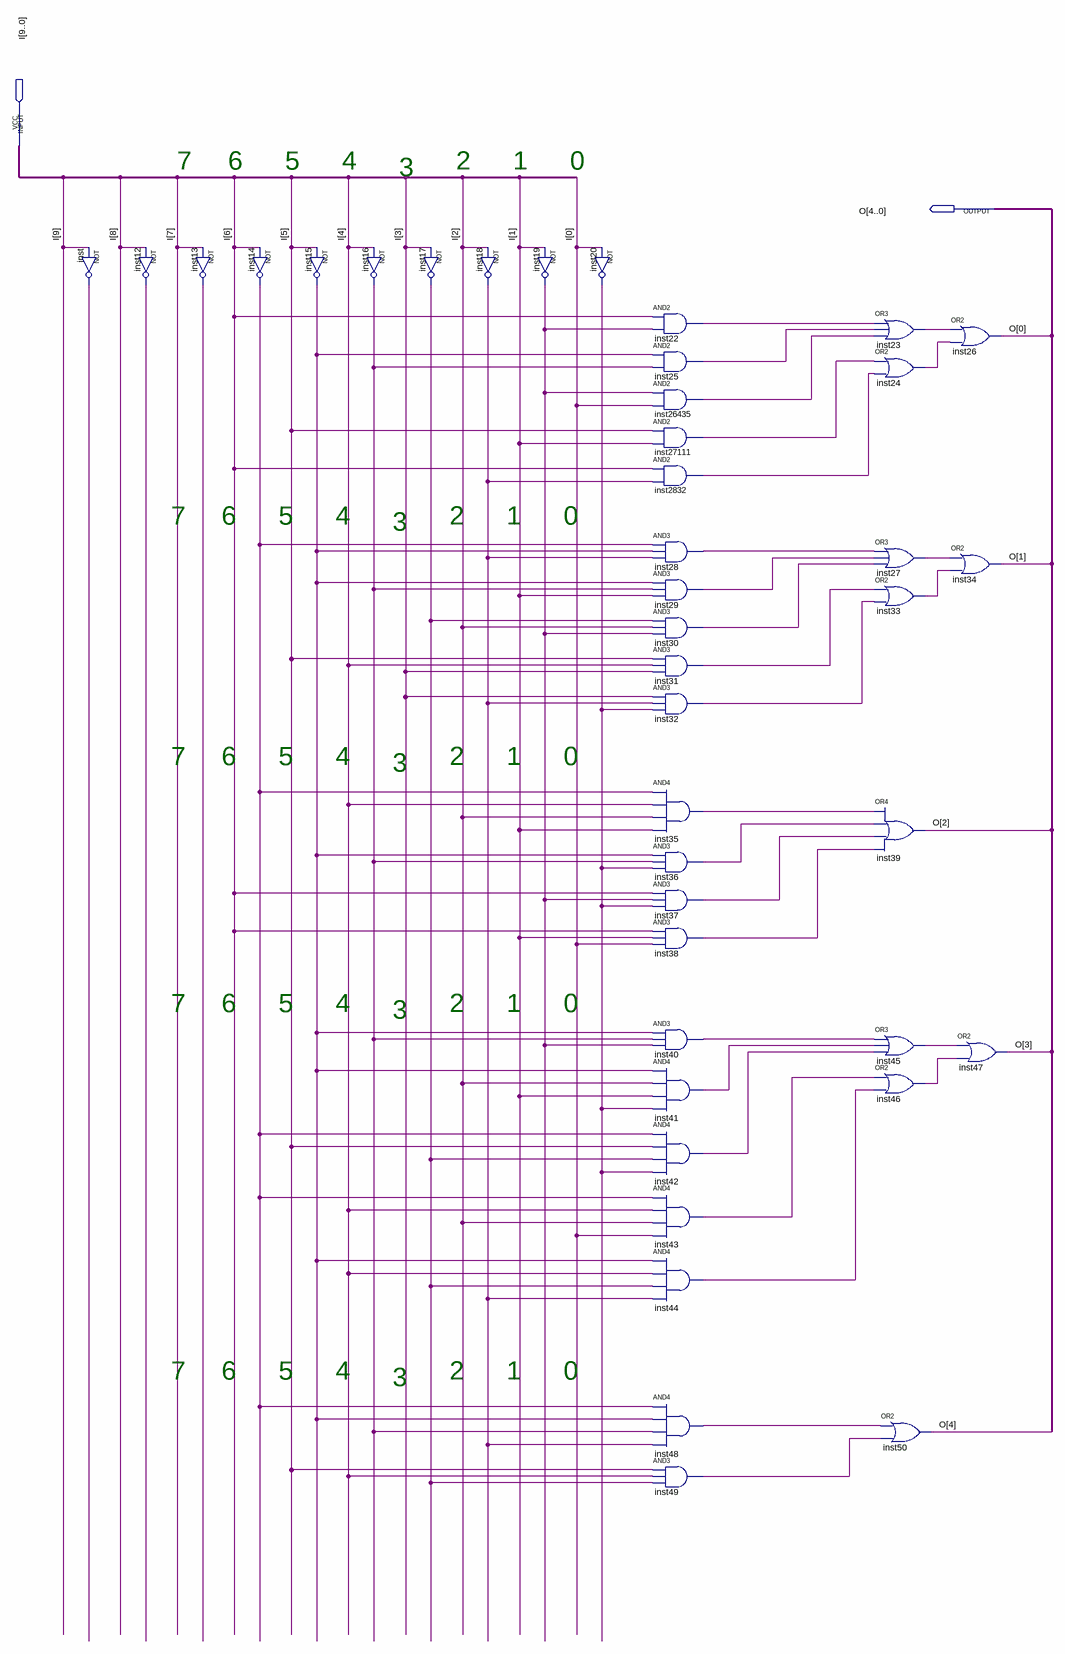
[diagram p0: schematic sheet]
// Quartus schematic Bin2TimeValue.bdf as structural Verilog: 42 symbols, 2 pins
module Bin2TimeValue (
  input  [9:0] I,
  output [4:0] O
);

  wire inst12_out, inst13_out, inst14_out, inst15_out, inst16_out, inst17_out, inst18_out, inst19_out,
       inst20_out, inst22_out, inst23_out, inst24_out, inst25_out, inst27_out, inst28_out, inst29_out,
       inst30_out, inst31_out, inst32_out, inst33_out, inst35_out, inst36_out, inst37_out, inst38_out,
       inst40_out, inst41_out, inst42_out, inst43_out, inst44_out, inst45_out, inst46_out, inst48_out,
       inst49_out, inst2832_out, inst26435_out, inst27111_out, inst_out;

  not inst (inst_out, I[9]);
  not inst12 (inst12_out, I[8]);
  not inst13 (inst13_out, I[7]);
  not inst14 (inst14_out, I[6]);
  not inst15 (inst15_out, I[5]);
  not inst16 (inst16_out, I[4]);
  not inst17 (inst17_out, I[3]);
  not inst18 (inst18_out, I[2]);
  not inst19 (inst19_out, I[1]);
  not inst20 (inst20_out, I[0]);
  and inst22 (inst22_out, I[6], inst19_out);
  and inst25 (inst25_out, inst15_out, inst16_out);
  and inst26435 (inst26435_out, inst19_out, I[0]);
  and inst27111 (inst27111_out, I[5], I[1]);
  and inst2832 (inst2832_out, I[6], inst18_out);
  and inst28 (inst28_out, inst14_out, inst15_out, inst18_out);
  and inst29 (inst29_out, inst15_out, inst16_out, I[1]);
  and inst30 (inst30_out, inst17_out, I[2], inst19_out);
  and inst31 (inst31_out, I[5], I[4], I[3]);
  and inst32 (inst32_out, I[3], inst18_out, inst20_out);
  and inst35 (inst35_out, inst14_out, I[4], I[2], I[1]);
  and inst36 (inst36_out, inst15_out, inst16_out, inst20_out);
  and inst37 (inst37_out, I[6], inst19_out, inst20_out);
  and inst38 (inst38_out, I[6], I[1], I[0]);
  and inst40 (inst40_out, inst15_out, inst16_out, inst19_out);
  and inst41 (inst41_out, inst15_out, I[2], I[1], inst20_out);
  and inst42 (inst42_out, inst14_out, I[5], inst17_out, inst20_out);
  and inst43 (inst43_out, inst14_out, I[4], I[2], I[0]);
  and inst44 (inst44_out, inst15_out, I[4], inst17_out, inst18_out);
  and inst48 (inst48_out, inst14_out, inst15_out, inst16_out, inst18_out);
  and inst49 (inst49_out, I[5], I[4], inst17_out);
  or inst23 (inst23_out, inst22_out, inst25_out, inst26435_out);
  or inst24 (inst24_out, inst27111_out, inst2832_out);
  or inst27 (inst27_out, inst28_out, inst29_out, inst30_out);
  or inst33 (inst33_out, inst31_out, inst32_out);
  or inst39 (O[2], inst35_out, inst36_out, inst37_out, inst38_out);
  or inst45 (inst45_out, inst40_out, inst41_out, inst42_out);
  or inst46 (inst46_out, inst43_out, inst44_out);
  or inst50 (O[4], inst48_out, inst49_out);
  or inst26 (O[0], inst23_out, inst24_out);
  or inst34 (O[1], inst27_out, inst33_out);
  or inst47 (O[3], inst45_out, inst46_out);

  // Notes on the sheet:
  //   7
  //   6
  //   5
  //   4
  //   2
  //   1
  //   0
  //   3
  //   7
  //   6
  //   5
  //   4
  //   2
  //   1
  //   0
  //   3
  //   7
  //   6
  //   5
  //   4
  //   2
  //   1
  //   0
  //   3
  //   7
  //   6
  //   5
  //   4
  //   2
  //   1
  //   0
  //   3
  //   7
  //   6
  //   5
  //   4
  //   2
  //   1
  //   0
  //   3
endmodule
